# EAGLE schematic RelayDelay (EAGLE 6.5.0)
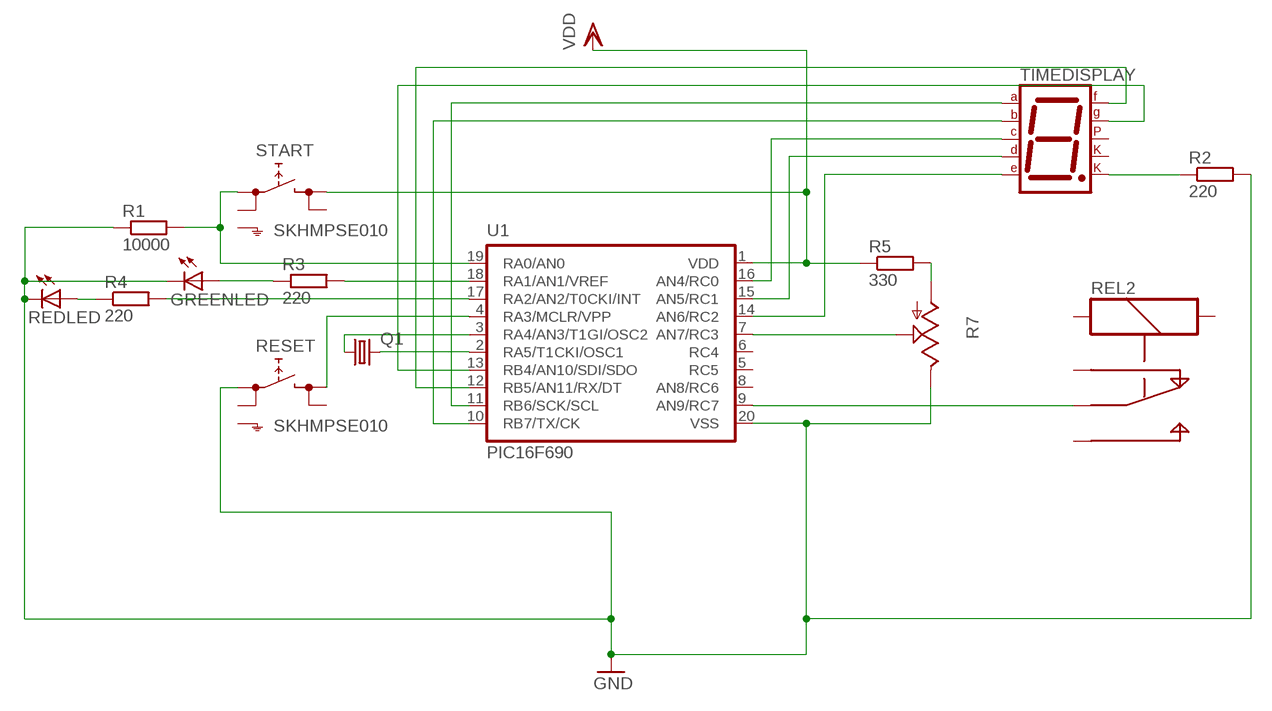
[diagram p0: schematic, sheet 1]

## Parts
GREENLED  LED  [SMARTLED-TTW]
Q1  CRYSTALHC49S  [HC49/S]
R1  10000  R-EU_0204/5  [0204/5]
R2  220  R-EU_0204/5  [0204/5]
R3  220  R-EU_0204/5  [0204/5]
R4  220  R-EU_0204/5  [0204/5]
R5  330  R-EU_0204/5  [0204/5]
R7  TRIM_US-CIP20C-6MM  [CIP20C-6MM]
REDLED  LED  [SMARTLED-TTW]
REL2  REL-5PIN  [REL-5PIN]
RESET  SKHMPSE010  [SKHMPXE010]
START  SKHMPSE010  [SKHMPXE010]
TIMEDISPLAY  7SEG-CK  [7SEG-13]
U1  PIC16F690  PIC16F6XX  [DIL20]

## Nets
GND: GREENLED.C@1(C) R1.1 R2.2 R7.E REDLED.C@1(C) RESET.1(1.1) U1.20(VSS)
N$1: R4.2 U1.17(RA2/AN2/T0CKI/INT)
N$2: R1.2 START.1(1.1) U1.19(RA0/AN0)
N$3: Q1.2 U1.2(RA5/T1CKI/OSC1)
N$4: Q1.1 U1.3(RA4/AN3/T1GI/OSC2)
N$5: GREENLED.A@1(A) R3.1
N$6: R4.1 REDLED.A@1(A)
N$7: RESET.3(2.1) U1.4(RA3/MCLR/VPP)
N$8: R3.2 U1.18(RA1/AN1/VREF)
N$9: R5.2 R7.A
N$10: R2.1 TIMEDISPLAY.8(CK2)
N$11: R7.S U1.7(AN7/RC3)
N$13: TIMEDISPLAY.7(A) U1.11(RB6/SCK/SCL)
N$14: TIMEDISPLAY.6(B) U1.10(RB7/TX/CK)
N$15: TIMEDISPLAY.4(C) U1.16(AN4/RC0)
N$16: TIMEDISPLAY.2(D) U1.15(AN5/RC1)
N$17: TIMEDISPLAY.1(E) U1.14(AN6/RC2)
N$18: TIMEDISPLAY.9(F) U1.12(RB5/AN11/RX/DT)
N$19: TIMEDISPLAY.10(G) U1.13(RB4/AN10/SDI/SDO)
N$20: REL2.C U1.9(AN9/RC7)
VDD: R5.1 START.3(2.1) U1.1(VDD)
Unconnected: REL2.O REL2.S REL2.S1 REL2.S2 RESET.2(1.2) RESET.4(2.2) RESET.5(SH) START.2(1.2) START.4(2.2) START.5(SH) TIMEDISPLAY.3(CK1) TIMEDISPLAY.5(DP) U1.5(RC5) U1.6(RC4) U1.8(AN8/RC6)

## Library data of the parts
GREENLED REDLED = led:LED: LED OSRAM: - CHIPLED LG R971, LG N971, LY N971, LG Q971, LY Q971, LO R971, LY R971 LH N974, LH R974 LS Q976, LO Q976, LY Q976 LO Q996 - Hyper CHIPLED LW Q18S LB Q993, LB Q99A, LB R99A - SideLED LS A670, LO A670, LY A670, LG A670, LP A670 LB A673, LV A673, LT A673, LW A673 LH A674 LY A675 LS A676, LA A676, LO A676, LY A676, LW A676 LS A679, LY A679, LG A679 - Hyper Micro SIDELED® LS Y876, LA Y876, LO Y876, LY Y876 LT Y87S - SmartLED LW L88C, LW L88S LB L89C, LB L89S, LG L890 LS L89K, LO L89K, LY L89K LS L896, LA L896, LO L896, LY L896 - TOPLED LS T670, LO T670, LY T670, LG T670, LP T670 LSG T670, LSP T670, LSY T670, LOP T670, LYG T670 LG T671, LOG T671, LSG T671 LB T673, LV T673, LT T673, LW T673 LH T674 LS T676, LA T676, LO T676, LY T676, LB T676, LH T676, LSB T676, LW T676 LB T67C, LV T67C, LT T67C, LS T67K, LO T67K, LY T67K, LW E67C LS E67B, LA E67B, LO E67B, LY E67B, LB E67C, LV E67C, LT E67C LW T67C LS T679, LY T679, LG T679 LS T770, LO T770, LY T770, LG T770, LP T770 LB T773, LV T773, LT T773, LW T773 LH T774 LS E675, LA E675, LY E675, LS T675 LS T776, LA T776, LO T776, LY T776, LB T776 LHGB T686 LT T68C, LB T68C - Hyper Mini TOPLED® LB M676 - Mini TOPLED Santana® LG M470 LS M47K, LO M47K, LY M47K Source: http://www.osram.convergy.de LUXEON: - LUMILED® LXK2-PW12-R00, LXK2-PW12-S00, LXK2-PW14-U00, LXK2-PW14-V00 LXK2-PM12-R00, LXK2-PM12-S00, LXK2-PM14-U00 LXK2-PE12-Q00, LXK2-PE12-R00, LXK2-PE12-S00, LXK2-PE14-T00, LXK2-PE14-U00 LXK2-PB12-K00, LXK2-PB12-L00, LXK2-PB12-M00, LXK2-PB14-N00, LXK2-PB14-P00, LXK2-PB14-Q00 LXK2-PR12-L00, LXK2-PR12-M00, LXK2-PR14-Q00, LXK2-PR14-R00 LXK2-PD12-Q00, LXK2-PD12-R00, LXK2-PD12-S00 LXK2-PH12-R00, LXK2-PH12-S00 LXK2-PL12-P00, LXK2-PL12-Q00, LXK2-PL12-R00 Source: www.luxeon.com KINGBRIGHT: KA-3528ASYC Source: www.kingbright.com
Q1 = crystal:CRYSTAL: CRYSTAL; OC_FARNELL: 1667008; OC_NEWARK: unknown
R1 R2 R5 = resistor:R-EU_: RESISTOR, European symbol
R3 R4 = rcl:R-EU_: RESISTOR, European symbol
R7 = pot:TRIM_US-: POTENTIOMETER
REL2 = special:REL-5PIN: RELAY
RESET START = switch:SKHMP*E010: 6.2 X 6.5mm TACT Switch (SMD) Source: http://www3.alps.co.jp/WebObjects/catalog.woa/PDF/E/Switch/Tact/SKHM/SKHM.PDF
TIMEDISPLAY = special:7SEG-CK: 7-segment DISPLAY single cathode, 13 mm
U1 = pic16f690:PIC16F6XX